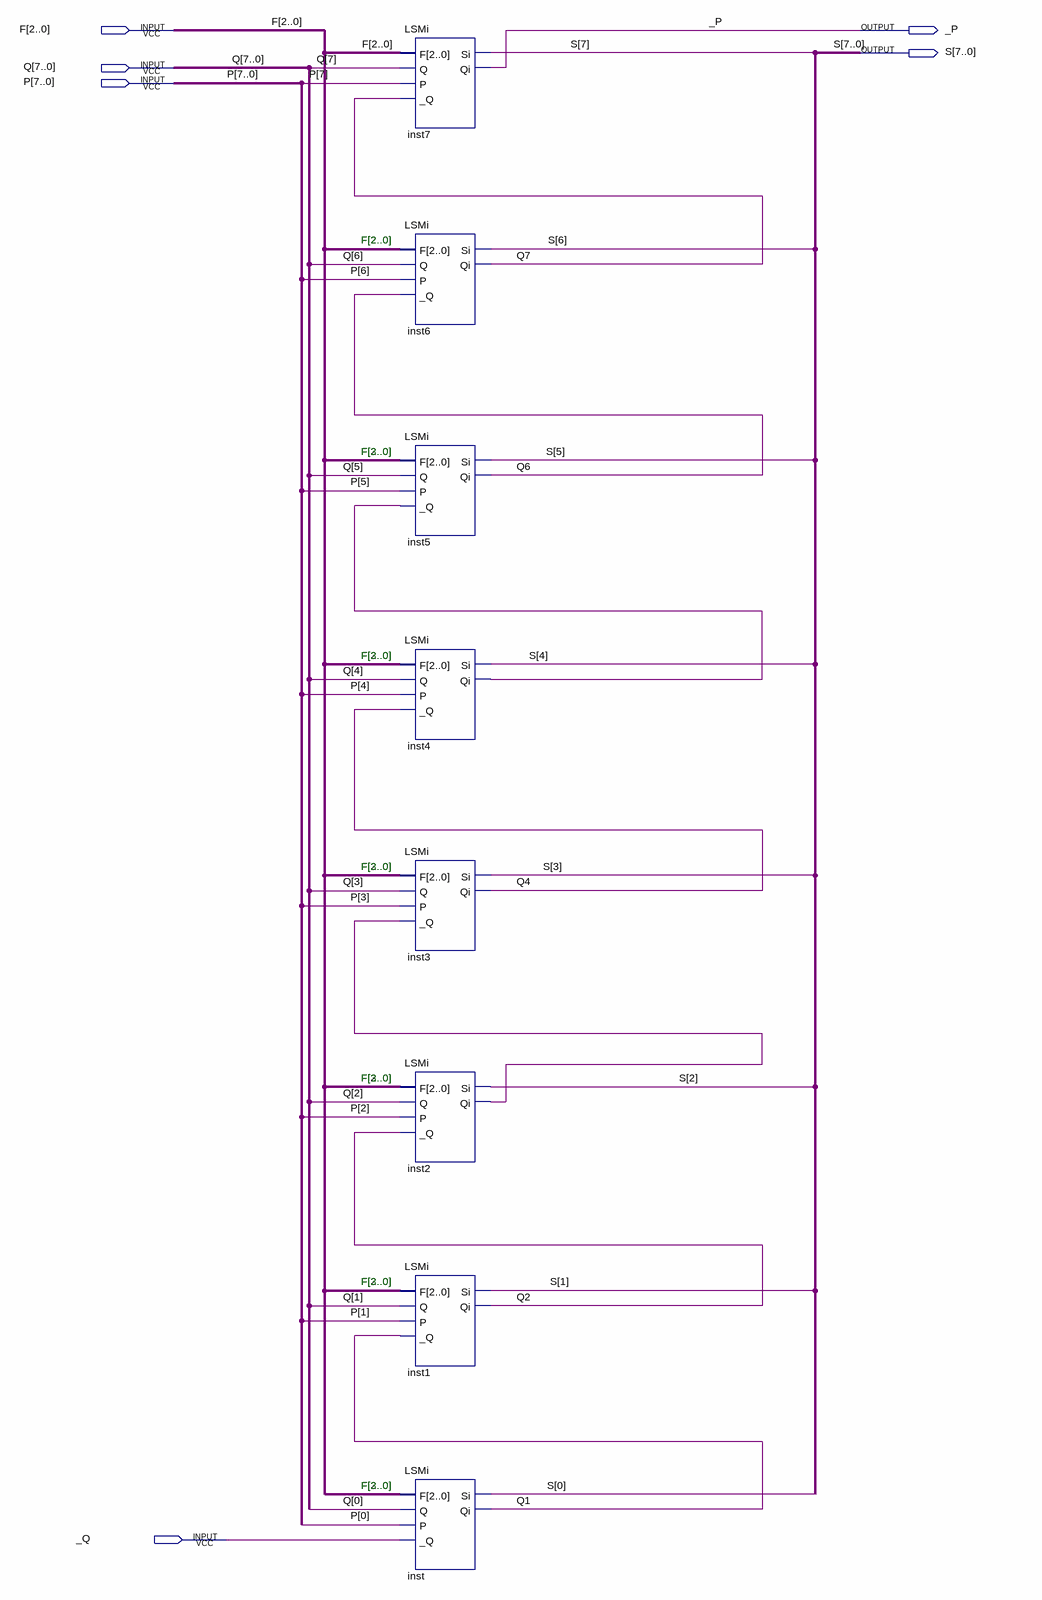
[diagram p0: schematic sheet]
// Quartus schematic LSM.bdf as structural Verilog: 8 symbols, 6 pins
module LSM (
  input  [2:0] F,
  input  [7:0] Q,
  input  [7:0] P,
  input  _Q,
  output _P,
  output [7:0] S
);

  wire inst2_qi, inst4_qi;

  LSMi inst7 (.F(F), .Q(Q[7]), .P(P[7]), ._Q(Q[7]), .Si(S[7]), .Qi(_P));
  LSMi inst6 (.F(F), .Q(Q[6]), .P(P[6]), ._Q(Q[6]), .Si(S[6]), .Qi(Q[7]));
  LSMi inst5 (.F(F), .Q(Q[5]), .P(P[5]), ._Q(inst4_qi), .Si(S[5]), .Qi(Q[6]));
  LSMi inst4 (.F(F), .Q(Q[4]), .P(P[4]), ._Q(Q[4]), .Si(S[4]), .Qi(inst4_qi));
  LSMi inst3 (.F(F), .Q(Q[3]), .P(P[3]), ._Q(inst2_qi), .Si(S[3]), .Qi(Q[4]));
  LSMi inst2 (.F(F), .Q(Q[2]), .P(P[2]), ._Q(Q[2]), .Si(S[2]), .Qi(inst2_qi));
  LSMi inst1 (.F(F), .Q(Q[1]), .P(P[1]), ._Q(Q[1]), .Si(S[1]), .Qi(Q[2]));
  LSMi inst (.F(F), .Q(Q[0]), .P(P[0]), ._Q(_Q), .Si(S[0]), .Qi(Q[1]));

  // Notes on the sheet:
  //   F[2..0]
  //   F[3..0]
  //   F[3..0]
  //   F[3..0]
  //   F[3..0]
  //   F[3..0]
  //   F[3..0]
endmodule
